# EAGLE design HID Board (EAGLE 9.0.1)
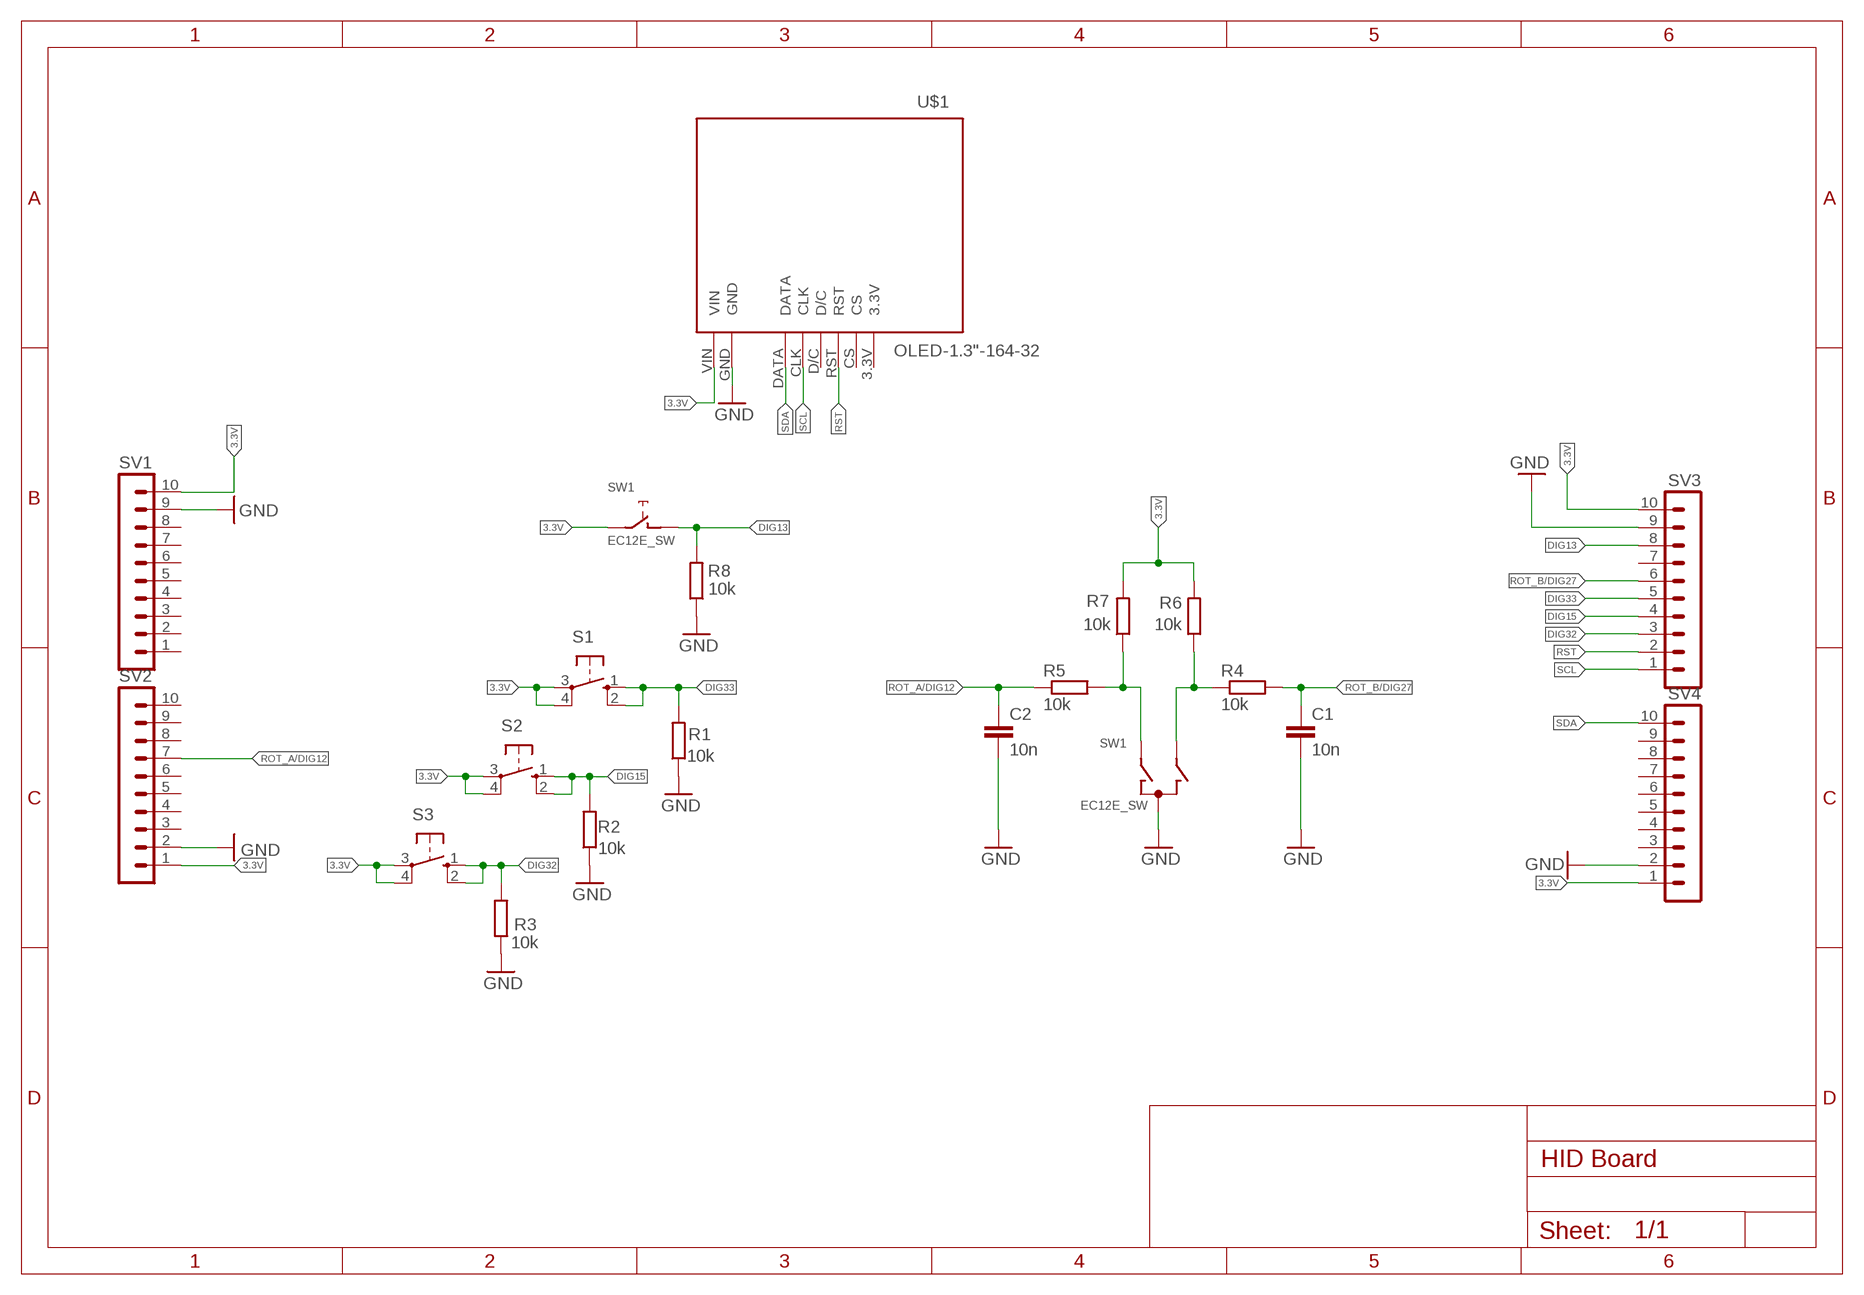
[diagram p0: schematic, sheet 1]

## Parts
C1  10n  C-EUC1206  [C1206]
C2  10n  C-EUC1206  [C1206]
R1  10k  R-EU_M1206  [M1206]
R2  10k  R-EU_M1206  [M1206]
R3  10k  R-EU_M1206  [M1206]
R4  10k  R-EU_M1206  [M1206]
R5  10k  R-EU_M1206  [M1206]
R6  10k  R-EU_M1206  [M1206]
R7  10k  R-EU_M1206  [M1206]
R8  10k  R-EU_M1206  [M1206]
S1  10-XX  [B3F-10XX]
S2  10-XX  [B3F-10XX]
S3  10-XX  [B3F-10XX]
SV1  MA10-1  [MA10-1]
SV2  MA10-1  [MA10-1]
SV3  MA10-1  [MA10-1]
SV4  MA10-1  [MA10-1]
SW1  EC12E_SW  [ALPS_EC12E_SW]
U$1  OLED-1.3"-164-32  [OLED-1.3"-164-32]

## Nets
3.3V: R6.2 R7.2 S1.3(P) S1.4(P1) S2.3(P) S2.4(P1) S3.3(P) S3.4(P1) SV1.10 SV2.1 SV3.10 SV4.1 SW1.E U$1.VIN
DIG13: R8.2 SV3.8 SW1.D
DIG15: R2.2 S2.1(S) S2.2(S1) SV3.4
DIG32: R3.2 S3.1(S) S3.2(S1) SV3.3
DIG33: R1.2 S1.1(S) S1.2(S1) SV3.5
GND: C1.2 C2.2 R1.1 R2.1 R3.1 R8.1 SV1.9 SV2.2 SV3.9 SV4.2 SW1.C U$1.GND
N$1: R5.2 R7.1 SW1.A
N$2: R4.1 R6.1 SW1.B
ROT_A/DIG12: C2.1 R5.1 SV2.7
ROT_B/DIG27: C1.1 R4.2 SV3.6
RST: SV3.2 U$1.RST
SCL: SV3.1 U$1.CLK
SDA: SV4.10 U$1.DATA
Unconnected: SV1.1 SV1.2 SV1.3 SV1.4 SV1.5 SV1.6 SV1.7 SV1.8 SV2.3 SV2.4 SV2.5 SV2.6 SV2.8 SV2.9 SV2.10 SV3.7 SV4.3 SV4.4 SV4.5 SV4.6 SV4.7 SV4.8 SV4.9 SW1.GND1(G) SW1.GND2(G) U$1.3.3V U$1.CS U$1.D/C

## Library data of the parts
C1 C2 = resistor:C-EU: CAPACITOR, European symbol
R1-R8 = resistor:R-EU_: RESISTOR, European symbol
S1-S3 = switch-omron:10-XX: OMRON SWITCH; MPN: B3F-1000; OC_FARNELL: 176432; OC_NEWARK: 36M3542
SV1-SV4 = con-lstb:MA10-1: PIN HEADER; OC_FARNELL: unknown; OC_NEWARK: unknown
SW1 = switch-alps:EC12E_SW: ALPS rotary Encoder EC12E series with switch; MPN: EC12E2424407; OC_FARNELL: 1520813; OC_NEWARK: 74M1068
U$1 = hallmar-lib:OLED-1.3"-164-32

## Board
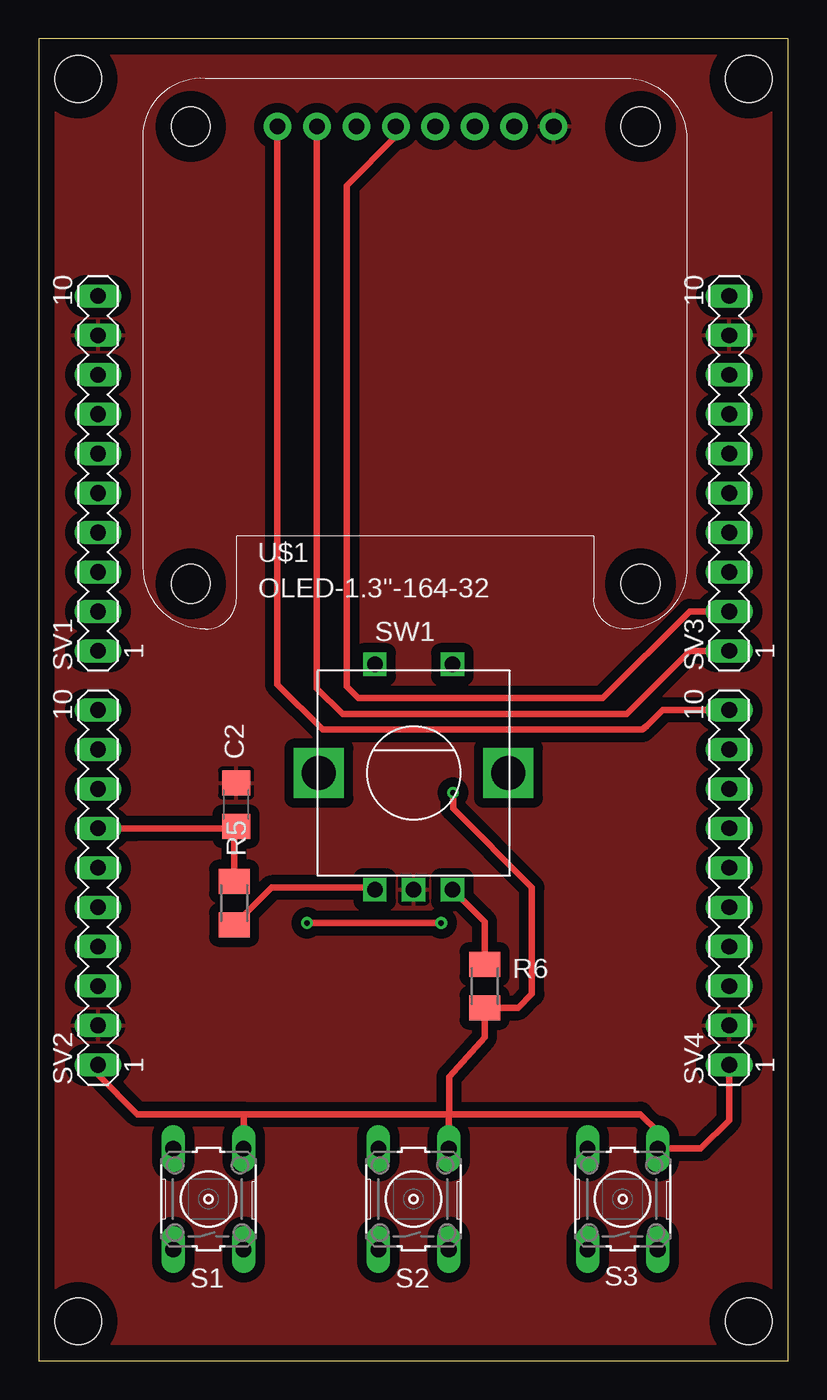
[diagram p1: board, top side]
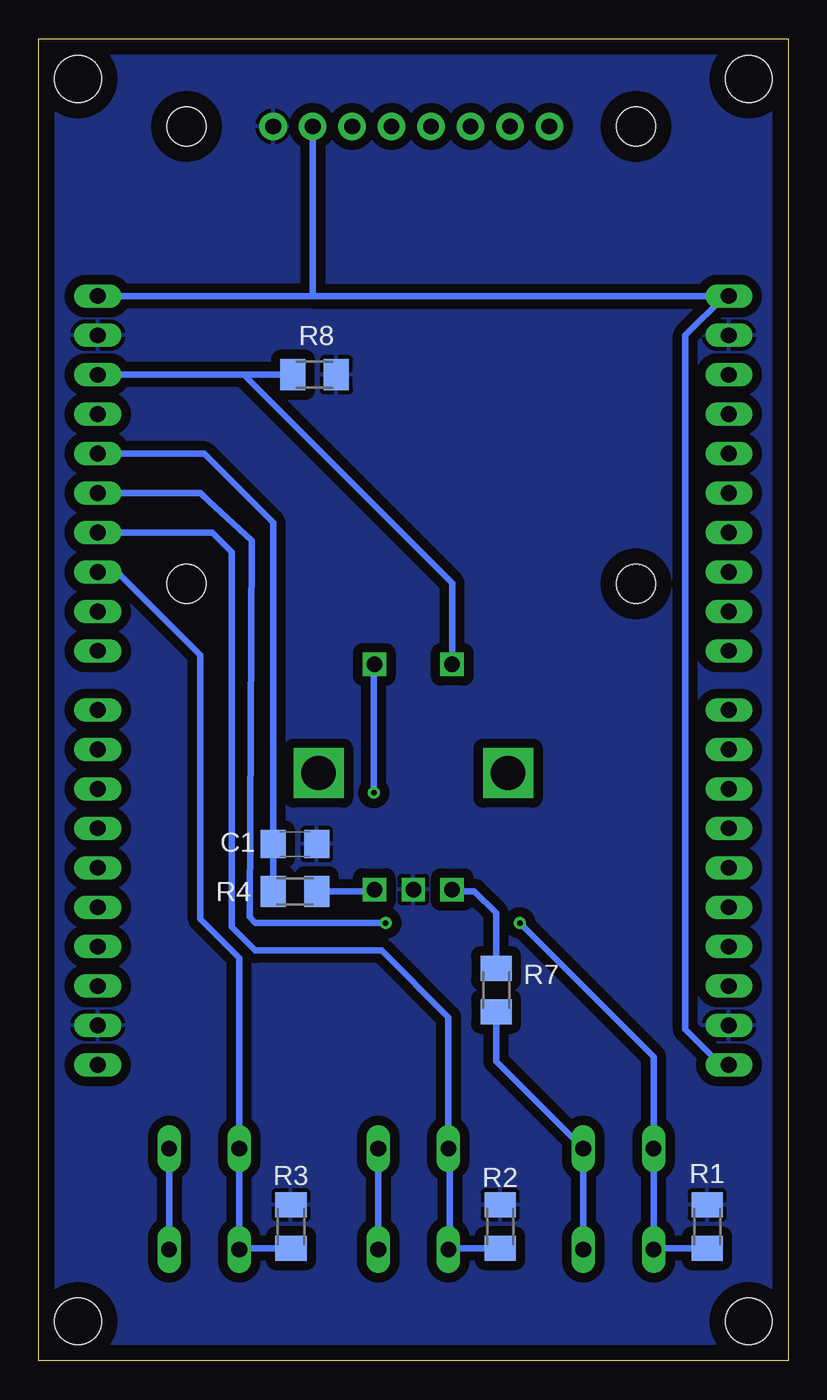
[diagram p2: board, bottom side, seen from below]

Size 48.24 x 85.14 mm. Coordinates in mm from the lower left corner, seen from the top.
Outline: 0,0 48.24,0 48.24,85.14 0,85.14 0,0
Copper layers (1*16): Top 0.035mm / dielectric 1.5mm / Bottom 0.035mm
Design rules "default": minimum track width 6mil, minimum drill 0.35mm, track to track 6mil, track to pad 6mil, pad to pad 6mil, via to via 6mil, smd to smd 6mil, copper to edge 40mil, drill to drill 6mil, minimum pad ring 10mil, minimum via ring 8mil, stop-mask expansion 4mil, vias tented up to drill 0mil, thermal gap 10mil
Holes 3 mm at 2.54,82.55 45.72,82.55 2.54,2.54 45.72,2.54

### Footprints (pad centres in the part's own frame; a part is rotated, then mirrored left to right if it is on the bottom)
C1206 = smd 1.6 x 1.8: 1 -1.4,0; 2 1.4,0
M1206 = smd 1.6 x 2: 1 -1.4,0; 2 1.4,0
B3F-10XX = drill 1.016 long: 1 -3.251,2.261; 2 3.251,2.261; 3 -3.251,-2.261; 4 3.251,-2.261
MA10-1 = drill 1.016 long: 1 -11.43,0; 2 -8.89,0; 3 -6.35,0; 4 -3.81,0; 5 -1.27,0; 6 1.27,0; 7 3.81,0; 8 6.35,0; 9 8.89,0; 10 11.43,0
ALPS_EC12E_SW = drill 1 square: A -2.5,-7.5; B 2.5,-7.5; C 0,-7.5; D -2.5,7; E 2.5,7 | drill 2.2 square: GND1 -6.1,0; GND2 6.1,0
OLED-1.3"-164-32 = drill 1.016 pad 1.778: 3.3V 21.336,32.512; CLK 11.176,32.512; CS 18.796,32.512; D/C 13.716,32.512; DATA 8.636,32.512; GND 26.416,32.512; RST 16.256,32.512; VIN 23.876,32.512 | hole 2.5: 3.048,3.048; 32.004,3.048; 3.048,32.512; 32.004,32.512

### Placement (x,y rotation side)
C1  31.75,33.27 0 bottom
C2  12.7,35.81 90 top
R1  5.21,8.64 270 bottom
R2  18.54,8.64 270 bottom
R3  32,8.64 270 bottom
R4  31.75,30.23 180 bottom
R5  12.57,29.46 270 top
R6  28.7,24.13 270 top
R7  18.8,23.88 270 bottom
R8  30.48,63.5 180 bottom
S1  10.92,10.41 90 top
S2  24.13,10.41 90 top
S3  37.59,10.41 90 top
SV1  3.81,57.15 90 top
SV2  3.81,30.48 90 top
SV3  44.45,57.15 90 top
SV4  44.45,30.48 90 top
SW1  24.13,37.85 0 top
U$1  6.73,46.99 0 top

### Tracks (layer width: path | path; a pad name or v marks a point on that pad's centre or on a via)
3.3V  (via drill 0.35)
  Top 0.406: 13.18,15.88 S1.4 | 13.18,15.88 26.39,15.88 | 26.39,15.88 26.39,15.75 | 26.39,15.75 S2.4 | 26.42,15.88 38.73,15.88 39.88,14.73 39.85,14.71 S3.4 42.62,13.66 44.45,15.49 SV4.1 | 13.18,15.88 6.35,15.88 3.81,18.42 SV2.1 | 26.42,15.9 26.39,15.88 | 26.42,15.88 26.42,18.29 28.7,20.83 R6.2 30.86,22.73 31.75,23.62 31.75,30.48 26.67,35.56 v26.67,36.58 26.67,36.07 | 26.42,15.88 26.39,15.88 | 26.42,15.88 26.42,15.77 26.39,15.75
  Bottom 0.406: U$1.VIN 30.61,68.58 | S3.4 S3.3 | S2.4 S2.3 | S1.3 S1.4 18.8,19.28 R7.2 | v26.67,36.58 26.67,44.81 SW1.E | 30.61,68.58 SV3.10 | SV2.1 4.32,19.05 6.6,21.34 6.6,66.04 4.06,68.58 | 4.06,68.58 SV1.10 | 30.61,68.58 4.06,68.58
DIG13
  Bottom 0.406: SW1.D 21.63,50.08 35.05,63.5 | R8.2 35.05,63.5 | 35.05,63.5 SV3.8
DIG15
  Bottom 0.406: R2.2 21.79,7.24 | 21.79,7.24 S2.1 | 21.79,7.24 21.79,13.59 S2.2 21.87,22.12 26.16,26.42 34.29,26.42 35.81,27.94 35.81,52.07 37.08,53.34 SV3.4
DIG32
  Bottom 0.406: R3.2 35.25,7.24 S3.1 S3.2 35.33,25.93 37.85,28.45 37.85,45.47 43.18,50.8 SV3.3
DIG33  (via drill 0.35)
  Top 0.406: v17.27,28.19 v25.91,28.19
  Bottom 0.406: R1.2 8.58,7.24 S1.1 S1.2 8.66,19.58 v17.27,28.19 | 37.3,55.37 34.54,52.83 34.67,28.57 34.29,28.19 v25.91,28.19 | 37.3,55.37 37.85,55.88 | 37.3,55.37 37.8,55.88 SV3.5
GND
  pour Bottom (isolate 0.61): -0.25,85.34 48.26,85.34 48.26,0.25 -0.25,0.25
  pour Top (isolate 0.61): 0.25,85.34 48.26,85.34 48.26,0 0.25,0
N$1
  Top 0.406: R5.2 14.99,30.48 21.59,30.48 21.51,30.23 SW1.A
  Bottom 0.406: R7.1 18.8,28.83 20.2,30.23 21.51,30.23 SW1.A
N$2
  Top 0.406: R6.1 28.7,28.27 28.49,28.49 SW1.B
  Bottom 0.406: R4.1 26.75,30.23 SW1.B
ROT_A/DIG12
  Top 0.406: R5.1 12.57,31.75 12.58,34.3 C2.1 | C2.1 12.58,34.41 | 6.35,34.29 SV2.7 12.58,34.29 C2.1
ROT_B/DIG27
  Bottom 0.406: R4.2 C1.1 33.15,53.98 37.59,58.42 SV3.6
RST
  Top 0.406: U$1.RST 22.99,78.87 19.81,75.69 19.81,43.43 20.57,42.67 36.32,42.67 41.91,48.26 SV3.2
SCL
  Top 0.406: U$1.CLK 17.91,43.31 19.56,41.66 37.85,41.66 41.91,45.72 SV3.1
SDA
  Top 0.406: U$1.DATA 15.37,43.56 18.29,40.64 38.86,40.64 39.14,40.89 40.16,41.91 SV4.10